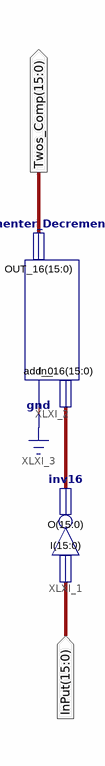
[diagram p0: schematic sheet 1]
// Xilinx ISE schematic Twos_Comp.sch (spartan3e) as structural Verilog: 2 symbols, 2 ports
module Twos_Comp (
  input  [15:0] InPut,
  output [15:0] Twos_Comp
);

  wire [15:0] XLXN_1;

  inv16 XLXI_1 (.I(InPut), .O(XLXN_1));
  Incrementer_Decrementer_16 XLXI_2 (.add_0(1'b0), .In_16(XLXN_1), .OUT_16(Twos_Comp));
endmodule
